# Altium schematic sheet ADCRead.SchDoc
size B
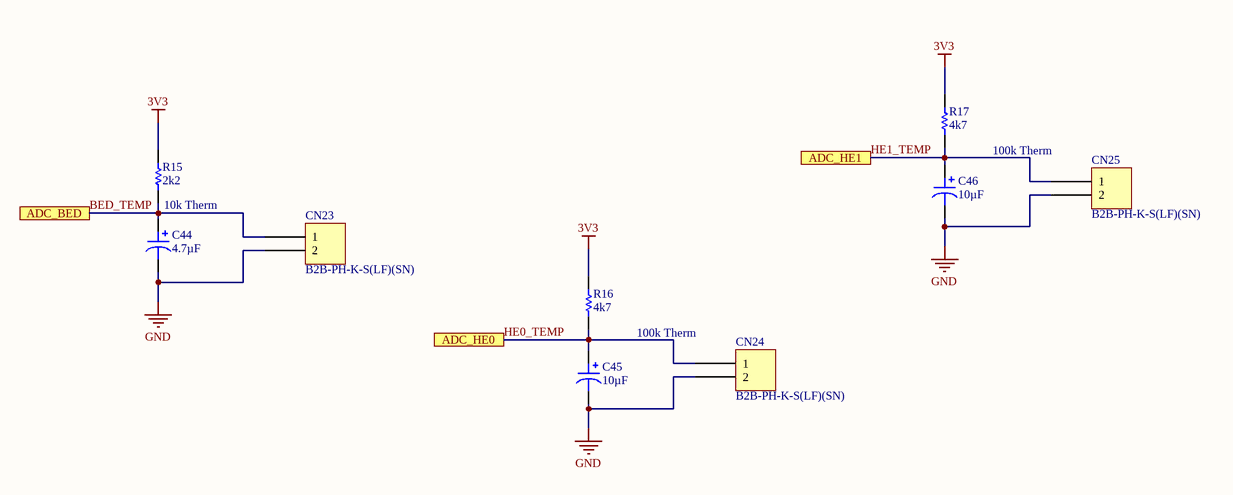
[diagram p0: ADCRead.SchDoc]

## Parts
C44  4.7µF  [CAP ALSMD POLY 4.3MM H5.5MM]
C45  10µF  [CAP ALSMD 5.3MM H5.4MM]
C46  10µF  [CAP ALSMD 5.3MM H5.4MM]
CN23  B2B-PH-K-S(LF)(SN)  [JST B2B-PH-K]
CN24  B2B-PH-K-S(LF)(SN)  [JST B2B-PH-K]
CN25  B2B-PH-K-S(LF)(SN)  [JST B2B-PH-K]
R15  value 2k2  [1608[0603]]  (hidden comment: Res1)
R16  value 4k7  [1608[0603]]  (hidden comment: Res1)
R17  value 4k7  [1608[0603]]  (hidden comment: Res1)

## Ports
ADC_BED, ADC_HE0, ADC_HE1

## Nets
3V3: R15.1 R16.1 R17.1
GND: C44.2 C45.2 C46.2 CN23.2 CN24.2 CN25.2
BED_TEMP: C44.1 CN23.1 R15.2 ; port ADC_BED
HE0_TEMP: C45.1 CN24.1 R16.2 ; port ADC_HE0
HE1_TEMP: C46.1 CN25.1 R17.2 ; port ADC_HE1

## Notes on the sheet
- 100k Therm
- 10k Therm

## Library data of the parts
C44 = PCF1A4R7MCL1GB: CAP ALUM POLY 4.7UF 20% 10V SMD; manufacturer: Nichicon; ESR (Equivalent Series Resistance): 240mOhm; Lifetime @ Temp.: 2000 Hrs @ 105°C; Ripple Current @ High Frequency: 670mA @ 100kHz; Surface Mount Land Size: 0.169" L x 0.169" W (4.30mm x 4.30mm); Type: Polymer; Part Number: PCF1A4R7MCL1GB; Applications: General Purpose; Capacitance: 4.7µF; componentlink1description: Datasheet; componentlink1url: http://nichicon-us.com/english/products/pdfs/e-pcf.pdf; componentlink2description: DigiKey Link; componentlink2url: http://digikey.com/product-detail/en/nichicon/PCF1A4R7MCL1GB/493-14005-1-ND/5180801; Device Package: Radial, Can - SMD; Height - Seated (Max): 0.217" (5.50mm); lastupdated: 9/2/2020 1:22:02 AM; Lifecycle Status: Active; Minimum Order: 1; Mounting Type: Surface Mount; Operating Temperature: -55°C ~ 105°C; Package / Case: Radial, Can - SMD; packaging: TapeAndReel; partid: 1859; Part Status: Active; price: 0.36; series: PCF; Size / Dimension: 0.157" Dia (4.00mm); Supplier 1: DigiKey; Supplier Part Number 1: 493-14005-1-ND; Tolerance: ±20%; value: 4.7µF; Voltage - Rated: 10V
C45 C46 = UZP1C100MCL1GB: CAP ALUM 10UF 20% 16V SMD; manufacturer: Nichicon; Lifetime @ Temp.: 2000 Hrs @ 85°C; Polarization: Bi-Polar; Ripple Current @ High Frequency: 34.5mA @ 10kHz; Ripple Current @ Low Frequency: 23mA @ 120Hz; Surface Mount Land Size: 0.209" L x 0.209" W (5.30mm x 5.30mm); Part Number: UZP1C100MCL1GB; Applications: General Purpose; Capacitance: 10µF; componentlink1description: Datasheet; componentlink1url: //media.digikey.com/pdf/Data%20Sheets/Nichicon%20PDFs/ZP_Series.pdf; componentlink2description: DigiKey Link; componentlink2url: http://digikey.com/product-detail/en/nichicon/UZP1C100MCL1GB/493-10077-1-ND/3983922; Device Package: Radial, Can - SMD; Height - Seated (Max): 0.181" (4.60mm); lastupdated: 9/2/2020 1:18:30 AM; Lifecycle Status: Active; Minimum Order: 1; Mounting Type: Surface Mount; Operating Temperature: -40°C ~ 85°C; Package / Case: Radial, Can - SMD; packaging: TapeAndReel; partid: 8608; Part Status: Active; price: 0.21; series: UZP; Size / Dimension: 0.197" Dia (5.00mm); Supplier 1: DigiKey; Supplier Part Number 1: 493-10077-1-ND; Tolerance: ±20%; value: 10µF; Voltage - Rated: 16V
CN23-CN25 = B2B-PH-K-S(LF)(SN): CONN HEADER VERT 2POS 2MM; Manufacturer: JST Sales America Inc.; Contact Length - Mating: 0.130" (3.30mm); Contact Length - Post: 0.134" (3.40mm); Current Rating (Amps): 2A; Material Flammability Rating: UL94 V-0; Number of Positions: 2; Number of Positions Loaded: All; Overall Contact Length: 0.333" (8.45mm); Pitch - Mating: 0.079" (2.00mm); Shrouding: Shrouded - 4 Wall; Style: Board to Cable/Wire; Voltage Rating: 100V; Part Number: B2B-PH-K-S(LF)(SN); ComponentLink1Description: Datasheet; ComponentLink1URL: http://www.jst-mfg.com/product/pdf/eng/ePH.pdf; ComponentLink2Description: DigiKey Link; ComponentLink2URL: http://digikey.com/product-detail/en/jst-sales-america-inc/B2B-PH-K-S-LF-SN/455-1704-ND/926611; Connector Type: Header; Contact Finish - Mating: Tin; Contact Finish - Post: Tin; Contact Material: Brass; Contact Shape: Square; Contact Type: Male Pin; Fastening Type: Detent Lock; Insulation Color: Natural; Insulation Height: 0.236" (6.00mm); Insulation Material: Polyamide (PA66), Nylon 6/6; LastUpdated: 1/3/2020 11:40:58 PM; Lifecycle Status: Active; Minimum Order: 1; Mounting Type: Through Hole; Number of Rows: 1; Operating Temperature: -25°C ~ 85°C; Packaging: Bulk; PartId: 11; Part Status: Active; Price: 0.17; Series: PH; Supplier 1: DigiKey; Supplier Part Number 1: 455-1704-ND; Termination: Press-Fit, Solder
R15-R17 = Res1: Resistor; Published: 8-Jun-2000; LatestRevisionDate: 17-Jul-2002; LatestRevisionNote: Re-released for DXP Platform.; PackageReference: AXIAL-0.3; Publisher: Altium Limited; PackageDescription: Axial Device, Thru-Hole; 2 Leads; 0.3 in Pin Spacing